# EasyEDA Pro project ProPrj_Piano_scan_for_conserts3_2026-02-26.epro, schematic reuse_base
Board Name: reuse_base; Create Date: 2026-01-01; Page Name: rb; Project Name: Piano_scan_for_conserts3; Schematic Name: reuse_base; Update Date: 2026-01-01; Company: EasyEDA.com; Page Size: A4; Version: V1.0
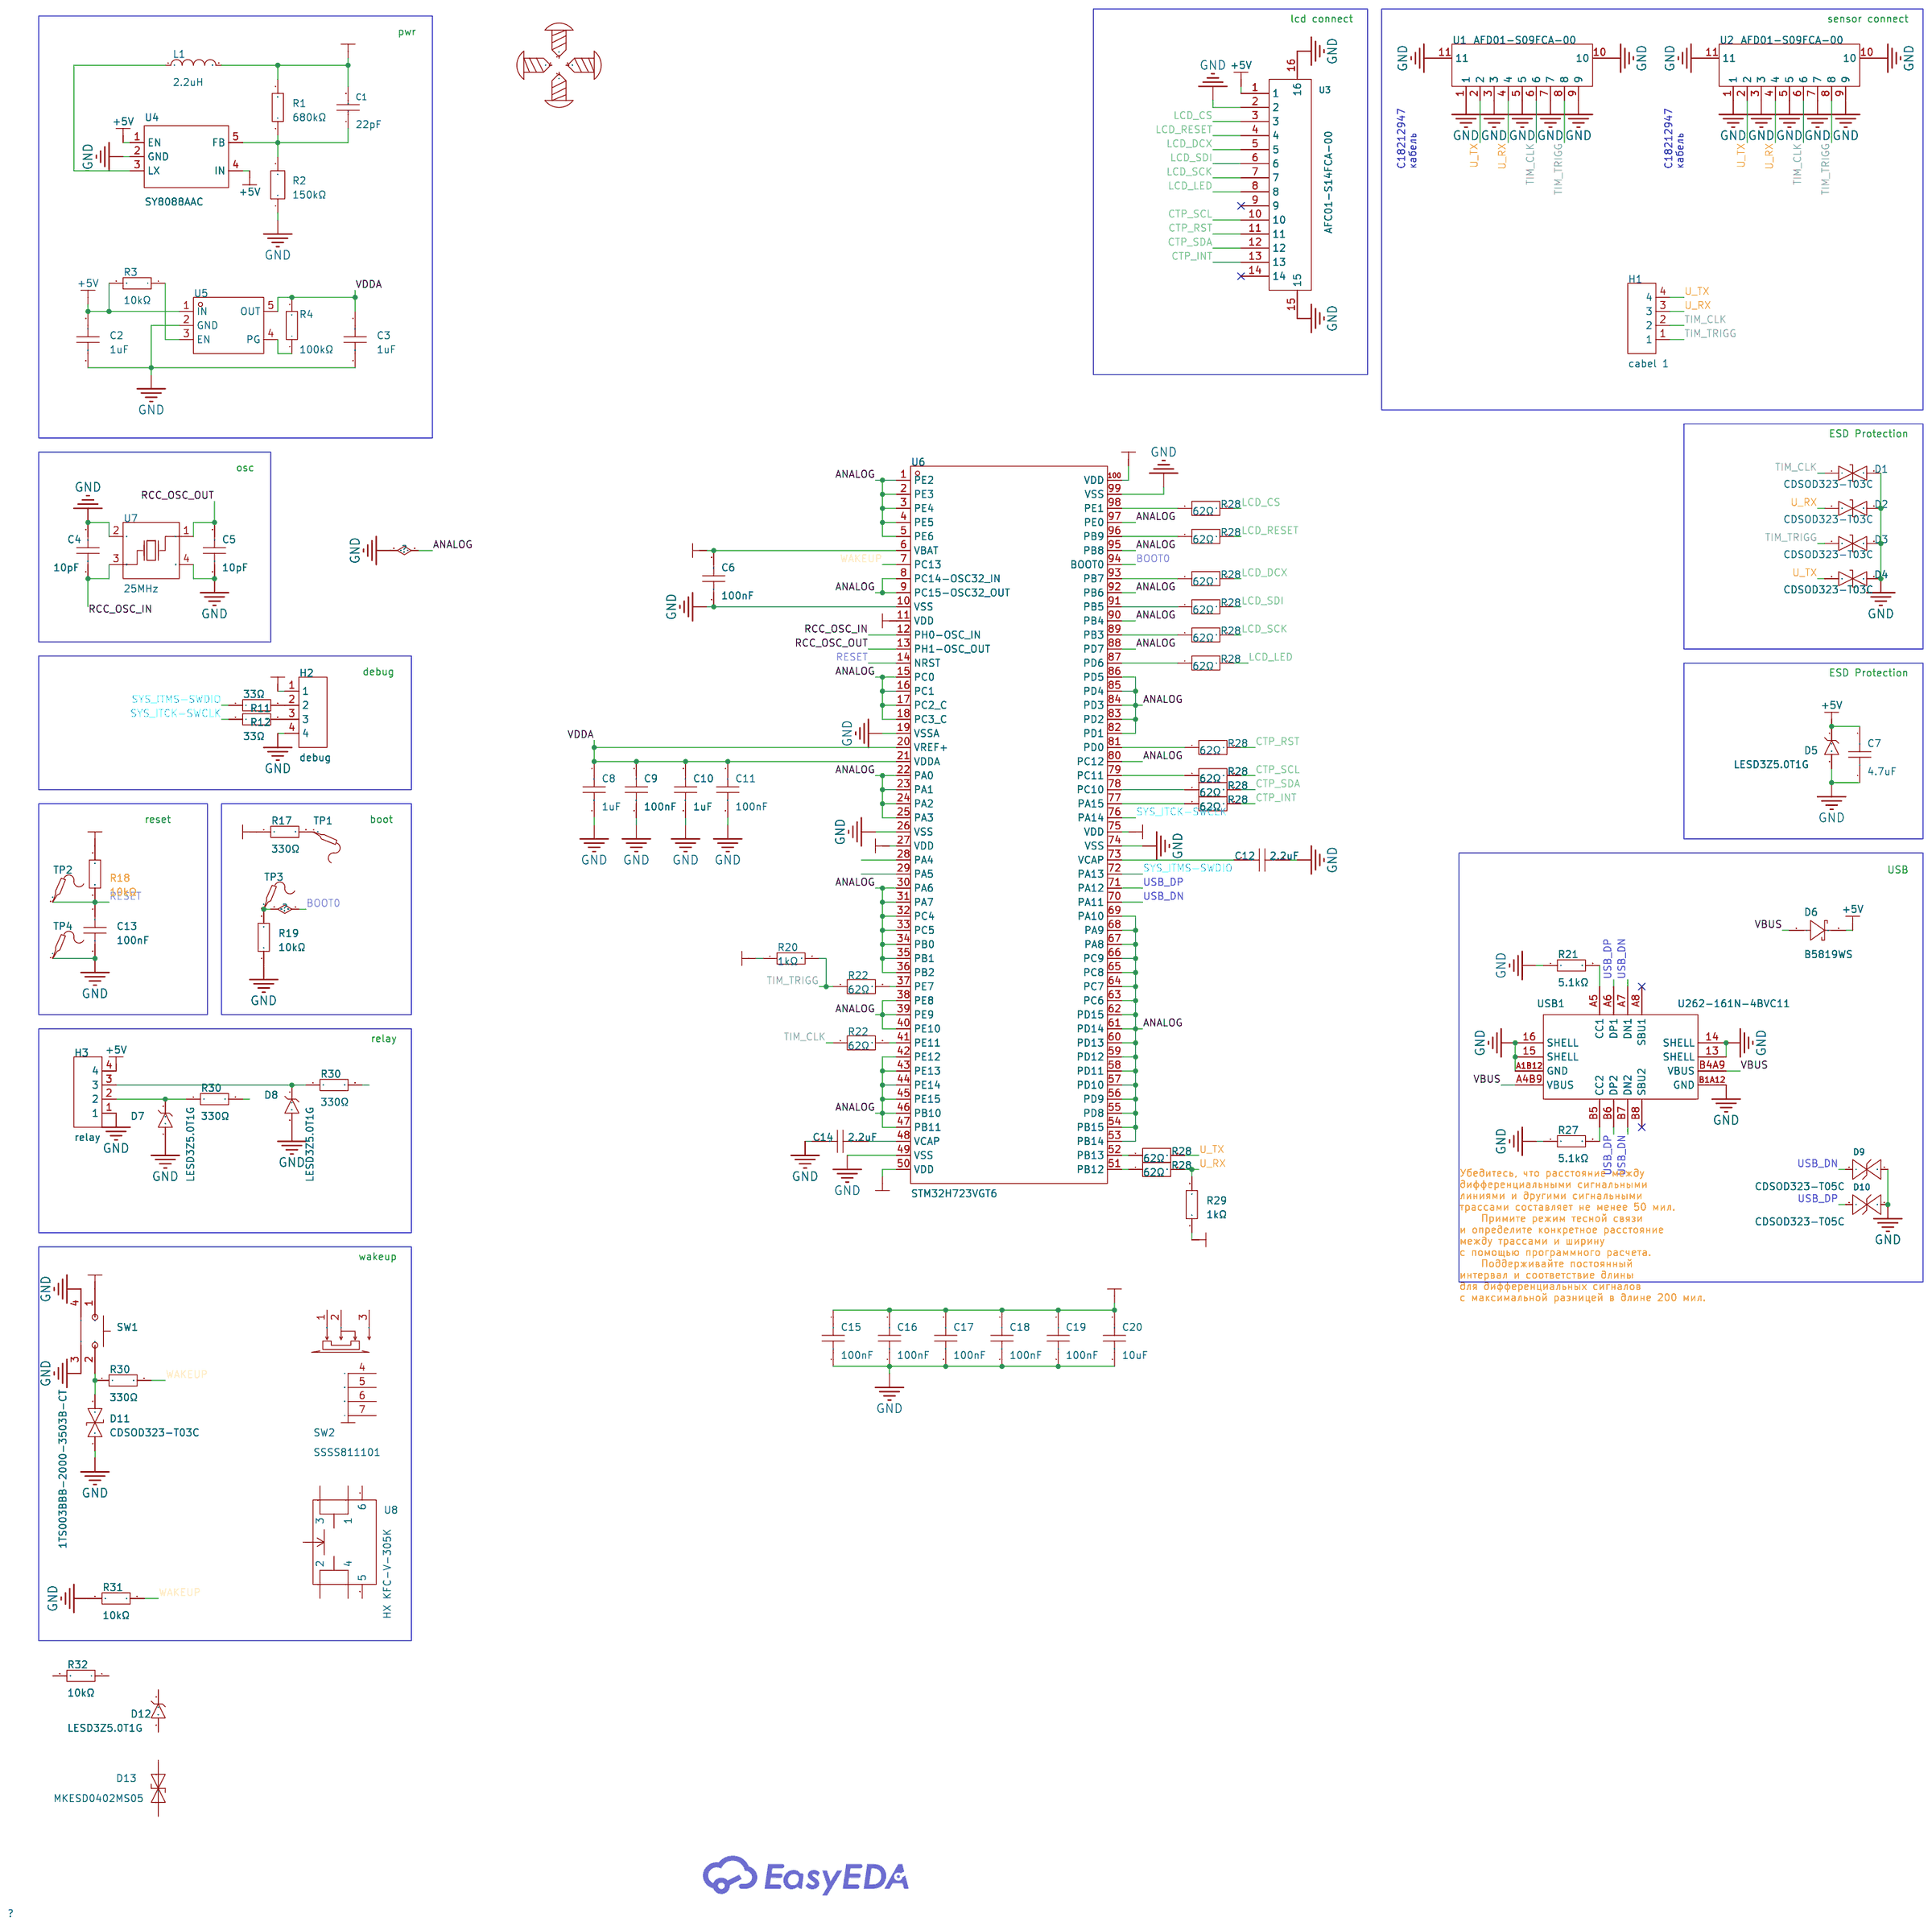
[diagram p0: schematic sheet]

## Parts
C1  22pF  [C0402]
C2  1uF  [C0402]
C3  1uF  [C0402]
C4  10pF  [C0402]
C5  10pF  [C0402]
C6  100nF  [C0402]
C7  4.7uF  [C0402]
C8  1uF  [C0402]
C9  100nF  [C0402]
C10  1uF  [C0402]
C11  100nF  [C0402]
C12  2.2uF  [C0402]
C13  100nF  [C0402]
C14  2.2uF  [C0402]
C15  100nF  [C0402]
C16  100nF  [C0402]
C17  100nF  [C0402]
C18  100nF  [C0402]
C19  100nF  [C0402]
C20  10uF  [C0402]
D1  CDSOD323-T03C  [SOD-323_L1.8-W1.3-LS2.5-BI]
D2  CDSOD323-T03C  [SOD-323_L1.8-W1.3-LS2.5-BI]
D3  CDSOD323-T03C  [SOD-323_L1.8-W1.3-LS2.5-BI]
D4  CDSOD323-T03C  [SOD-323_L1.8-W1.3-LS2.5-BI]
D5  LESD3Z5.0T1G  [SOD-323_L1.8-W1.3-LS2.5-RD]
D6  B5819WS  [SOD-323_L1.7-W1.3-LS2.5-RD]
D7  LESD3Z5.0T1G  [SOD-323_L1.8-W1.3-LS2.5-RD]
D8  LESD3Z5.0T1G  [SOD-323_L1.8-W1.3-LS2.5-RD]
D9  CDSOD323-T05C  [SOD-323_L1.8-W1.3-LS2.5-BI]
D10  CDSOD323-T05C  [SOD-323_L1.8-W1.3-LS2.5-BI]
D11  CDSOD323-T03C  [SOD-323_L1.8-W1.3-LS2.5-BI]
D12  LESD3Z5.0T1G  [SOD-323_L1.8-W1.3-LS2.5-RD]  (no BOM)
D13  MKESD0402MS05  [D0402-BI]  (no BOM)
H1  cabel 1  [HDR-TH_4P-P2.54-V-M]  (no BOM)
H2  debug  [HDR-TH_4P-P2.54-V-M]  (no BOM)
H3  relay  [HDR-TH_4P-P2.54-V-M]  (no BOM)
L1  2.2uH  [IND-SMD_L1.2-W0.7]
R1  680kΩ  [R0402]
R2  150kΩ  [R0402]
R3  10kΩ  [R0402]
R4  100kΩ  [R0402]
R11  33Ω  [R0402]
R12  33Ω  [R0402]
R17  330Ω  [R0402]
R18  10kΩ  [R0402]
R19  10kΩ  [R0402]
R20  1kΩ  [R0402]
R21  5.1kΩ  [R0402]
R22  62Ω  [R0402]
R22#2  62Ω  [R0402]
R27  5.1kΩ  [R0402]
R28  62Ω  [R0402]
R28#2  62Ω  [R0402]
R28#3  62Ω  [R0402]
R28#4  62Ω  [R0402]
R28#5  62Ω  [R0402]
R28#6  62Ω  [R0402]
R28#7  62Ω  [R0402]
R28#8  62Ω  [R0402]
R28#9  62Ω  [R0402]
R28#10  62Ω  [R0402]
R28#11  62Ω  [R0402]
R28#12  62Ω  [R0402]
R29  1kΩ  [R0402]
R30  330Ω  [R0402]
R30#2  330Ω  [R0402]
R30#3  330Ω  [R0402]
R31  10kΩ  [RES-TH_BD1.8-L3.2-P7.20-D0.4]  (no BOM)
R32  10kΩ  [R0402]  (no BOM)
SCREW1  -  [Screw-Hole-M3]  (no BOM)
SCREW2  -  [Screw-Hole-M3]  (no BOM)
SCREW3  -  [Screw-Hole-M3]  (no BOM)
SCREW4  -  [Screw-Hole-M3]  (no BOM)
SW1  1TS003BBB-2000-3503B-CT  [KEY-SMD_1TS003B]
SW2  SSSS811101  [SW-SMD_SSSS811101]  (no BOM)
TP1  -  [Test-Point-0.5mm]  (no BOM)
TP2  -  [Test-Point-0.5mm]  (no BOM)
TP3  -  [Test-Point-0.5mm]  (no BOM)
TP4  -  [Test-Point-0.5mm]  (no BOM)
U1  AFD01-S09FCA-00  [FPC-SMD_9P-P0.50_JS_AFD01-S09FCA-00]
U2  AFD01-S09FCA-00  [FPC-SMD_9P-P0.50_JS_AFD01-S09FCA-00]
U3  AFC01-S14FCA-00  [FPC-SMD_AFC01-S14FCA-00]
U4  SY8088AAC  [SOT-23-5_L3.0-W1.7-P0.95-LS2.8-BR]
U5  LDLN030G33R  [TSOT-23-5_L2.9-W1.6-P0.95-LS2.8-BR]
U6  STM32H723VGT6  [LQFP-100_L14.0-W14.0-P0.50-LS16.0-BL]
U7  25MHz  [CRYSTAL-SMD_4P-L3.2-W2.5-BL-1]
U8  HX KFC-V-305K  [SW-SMD_TM-1022-B]  (no BOM)
USB1  U262-161N-4BVC11  [USB-3.1-SMD_U262-161N-4BVC11]

## Library data of the parts
C1 = CC0402JRNPO9BN220: Capacitance:22pF Tolerance:±5% Tolerance:±5% Voltage Rating:50V Temperature Coefficient:NP0; LCSC Part Name: 22pF ±5% 50V; Supplier Part: C106203; Manufacturer: YAGEO(国巨); Supplier Footprint: 0402; JLCPCB Part Class: Extended Part; Datasheet: https://item.szlcsc.com/datasheet/CC0402JRNPO9BN220/107418.html; Supplier: LCSC; Tolerance: ±5%; Voltage Rating: 50V; Temperature Coefficient: NP0
C2 C3 C8 C10 = CL05A105KA5NQNC: Capacitance: Tolerance:±10% Tolerance:±10% Voltage Rated: Temperature Coefficient:; LCSC Part Name: 1uF ±10% 25V; Supplier Part: C52923; Manufacturer: SAMSUNG(三星); Supplier Footprint: 0402; JLCPCB Part Class: Basic Part; Datasheet: https://atta.szlcsc.com/upload/public/pdf/source/20160218/1457707763339.pdf; Supplier: LCSC; Tolerance: ±10%
C4 C5 = CC0402JRNPO9BN100: Capacitance: Tolerance:±5% Tolerance:±5% Voltage Rated: Temperature Coefficient:; LCSC Part Name: 10pF ±5% 50V; Supplier Part: C106199; Manufacturer: YAGEO(国巨); Supplier Footprint: 0402; JLCPCB Part Class: Extended Part; Datasheet: https://atta.szlcsc.com/upload/public/pdf/source/20181008/C309499_21CC21451B82C39E3D92150FD6B30293.pdf; Supplier: LCSC; Tolerance: ±5%
C6 C9 C11 C13 C15-C19 = CL05B104KO5NNNC: Capacitance: Tolerance:±10% Tolerance:±10% Voltage Rated: Temperature Coefficient:; LCSC Part Name: 100nF ±10% 16V; Supplier Part: C1525; Manufacturer: SAMSUNG(三星); Supplier Footprint: 0402; JLCPCB Part Class: Basic Part; Datasheet: https://atta.szlcsc.com/upload/public/pdf/source/20160218/1457707763339.pdf; Supplier: LCSC; Tolerance: ±10%
C7 = CL05A475MO5NUNC: Capacitance: Tolerance:±20% Tolerance:±20% Voltage Rated: Temperature Coefficient:; LCSC Part Name: 4.7uF ±20% 16V; Supplier Part: C318563; Manufacturer: SAMSUNG(三星); Supplier Footprint: 0402; JLCPCB Part Class: Extended Part; Datasheet: https://atta.szlcsc.com/upload/public/pdf/source/20220707/F14E03FDB4B4C1D977DC3E44ED5514DB.pdf; Supplier: LCSC; Tolerance: ±20%
C12 C14 = CL05A225KO5NQNC: Capacitance: Tolerance:±10% Tolerance:±10% Voltage Rated: Temperature Coefficient:; LCSC Part Name: 2.2uF ±10% 16V; Supplier Part: C170151; Manufacturer: SAMSUNG(三星); Supplier Footprint: 0402; JLCPCB Part Class: Extended Part; Datasheet: https://atta.szlcsc.com/upload/public/pdf/source/20160218/1457707763339.pdf; Supplier: LCSC; Tolerance: ±10%
C20 = CL05A106MQ5NUNC: Capacitance: Tolerance:±20% Tolerance:±20% Voltage Rated: Temperature Coefficient:; LCSC Part Name: 10uF ±20% 6.3V; Supplier Part: C15525; Manufacturer: SAMSUNG(三星); Supplier Footprint: 0402; JLCPCB Part Class: Basic Part; Datasheet: https://atta.szlcsc.com/upload/public/pdf/source/20220823/2B02EE04F8F211D38A52DCB16EB6BEBA.pdf; Supplier: LCSC; Tolerance: ±20%
D1-D4 D11 = CDSOD323-T03C: Reverse Stand-Off Voltage (Vrwm):3.3V Maximum Clamping Voltage:19V Peak Pulse Power Dissipation (Ppp)@10/1000us:350W Breakdown Voltage:4V Number of Lines:单路 Operating Temperature:-55℃~+150℃@(Tj) Operating Temperature:-55℃~+150℃@(Tj) Type:ESD; Supplier Part: C711705; Manufacturer: BOURNS; Supplier Footprint: SOD-323; JLCPCB Part Class: Extended Part; Datasheet: https://atta.szlcsc.com/upload/public/pdf/source/20200729/C711705_B092C80AA6073E77CC27CA73EB4B9B57.pdf; Supplier: LCSC; Reverse Stand-Off Voltage (Vrwm): 3.3V; Maximum Clamping Voltage: 19V; Peak Pulse Power Dissipation (Ppp)@10/1000us: 350W; Breakdown Voltage: 4V; Number of Lines: 单路; Operating Temperature: -55℃~+150℃@(Tj); Type: ESD
D5 D7 D8 D12 = LESD3Z5.0T1G: polarity:Unidirectional Reverse Stand-Off Voltage (Vrwm):5V Maximum Clamping Voltage:9.8V Peak Pulse Current (Ipp):5A Breakdown Voltage:6V Type:ESD; LCSC Part Name: 单向ESD; Supplier Part: C383210; Manufacturer: LRC(乐山无线电); Supplier Footprint: SOD-323; JLCPCB Part Class: Extended Part; Datasheet: https://atta.szlcsc.com/upload/public/pdf/source/20190402/C383210_DDD0E74F94EB08ED87EF5997177DDCE4.pdf; Supplier: LCSC; polarity: Unidirectional; Reverse Stand-Off Voltage (Vrwm): 5V; Maximum Clamping Voltage: 9.8V; Peak Pulse Current (Ipp): 5A; Breakdown Voltage: 6V; Type: ESD
D6 = B5819WS_C916992: Forward Voltage (Vf@If):600mV@1A Reverse Voltage (Vr):40V Rectified Current:1A Reverse Leakage Current (Ir):1mA@40V; LCSC Part Name: 电压:40V 电流:1A; Supplier Part: C916992; Manufacturer: JSMSEMI(杰盛微); Supplier Footprint: SOD-323; JLCPCB Part Class: Extended Part; Datasheet: https://atta.szlcsc.com/upload/public/pdf/source/20230807/E118DF7B8391036A3C9742A49E2062A6.pdf; Supplier: LCSC; Forward Voltage (Vf@If): 600mV@1A; Reverse Voltage (Vr): 40V; Rectified Current: 1A; Reverse Leakage Current (Ir): 1mA@40V
D9 D10 = CDSOD323-T05C: Maximum Clamping Voltage:18.3V Breakdown Voltage:6V Number of Lines:单路 Type:ESD; Supplier Part: C711706; Manufacturer: BOURNS; Supplier Footprint: SOD-323; JLCPCB Part Class: Extended Part; Datasheet: https://atta.szlcsc.com/upload/public/pdf/source/20200729/C711705_B092C80AA6073E77CC27CA73EB4B9B57.pdf; Supplier: LCSC; Maximum Clamping Voltage: 18.3V; Breakdown Voltage: 6V; Number of Lines: 单路; Type: ESD
D13 = MKESD0402MS05: Maximum Clamping Voltage:40V Type:ESD; LCSC Part Name: 停产; Supplier Part: C379107; Supplier Footprint: 0402; JLCPCB Part Class: Extended Part; Datasheet: https://atta.szlcsc.com/upload/public/pdf/source/20190621/C379107_0EACA80B6F1F1E245949AB39A6E05B4D.pdf; Supplier: LCSC; Maximum Clamping Voltage: 40V; Type: ESD
H1-H3 = HDR-M_2.54_1x4P: Supplier Footprint: Through
L1 = WI0402IF2R2KST-HF: Inductance:2.2uH Tolerance:±10% Tolerance:±10% Current Rating:- Current - Saturation (Isat):40mA DC Resistance(DCR):2.3Ω Q @ Frequency:- Frequency - Self Resonant:100MHz Ratings:- Type:Wirewound Chip Inductor; LCSC Part Name: 2.2uH ±10% 40mA; Supplier Part: C18221127; Manufacturer: DDY(德立); Supplier Footprint: 0402; JLCPCB Part Class: Extended Part; Datasheet: https://item.szlcsc.com/datasheet/WI0402IF2R2KST-HF/19401023.html; Supplier: LCSC; Tolerance: ±10%; Current - Saturation (Isat): 40mA; DC Resistance(DCR): 2.3Ω; Frequency - Self Resonant: 100MHz; Type: Wirewound Chip Inductor
R1 = RC0402FR-07680KL: Type:Thick Film Resistor Resistance:680kΩ Tolerance:±1% Tolerance:±1% Power(Watts):62.5mW Voltage-Supply(Max):50V Temperature Coefficient:±100ppm/℃ Temperature Coefficient:±100ppm/℃ Operating Temperature:-55℃~+155℃ Operating Temperature:-55℃~+155℃; LCSC Part Name: 厚膜电阻 680kΩ ±1% 62.5mW; Supplier Part: C163456; Manufacturer: YAGEO(国巨); Supplier Footprint: 0402; JLCPCB Part Class: Extended Part; Datasheet: https://item.szlcsc.com/datasheet/RC0402FR-07680KL/174837.html; Supplier: LCSC; Type: Thick Film Resistor; Tolerance: ±1%; Power(Watts): 62.5mW; Voltage-Supply(Max): 50V; Temperature Coefficient: ±100ppm/℃; Operating Temperature: -55℃~+155℃
R2 = RT0402BRD07150KL: Type:Thin Film Resistor Resistance:150kΩ Tolerance:±0.1% Tolerance:±0.1% Power(Watts):63mW Voltage-Supply(Max):50V Temperature Coefficient:±25ppm/℃ Temperature Coefficient:±25ppm/℃ Operating Temperature:-55℃~+155℃ Operating Temperature:-55℃~+155℃; LCSC Part Name: 薄膜电阻 150kΩ ±0.1% 63mW; Supplier Part: C852538; Manufacturer: YAGEO(国巨); Supplier Footprint: 0402; JLCPCB Part Class: Extended Part; Datasheet: https://item.szlcsc.com/datasheet/RT0402BRD07150KL/912860.html; Supplier: LCSC; Type: Thin Film Resistor; Tolerance: ±0.1%; Power(Watts): 63mW; Voltage-Supply(Max): 50V; Temperature Coefficient: ±25ppm/℃; Operating Temperature: -55℃~+155℃
R3 R18 R19 R32 = RC0402FR-0710KL: Type:Thick Film Resistors Resistance: Tolerance:±1% Tolerance:±1% Power(Watts): Overload Voltage (Max): Temperature Coefficient:±100ppm/℃ Temperature Coefficient:±100ppm/℃ Operating Temperature Range:-55℃~+155℃ Operating Temperature Range:-55℃~+155℃; LCSC Part Name: 厚膜电阻 10kΩ ±1% 62.5mW; Supplier Part: C60490; Manufacturer: YAGEO(国巨); Supplier Footprint: 0402; JLCPCB Part Class: Extended Part; Datasheet: https://atta.szlcsc.com/upload/public/pdf/source/20170925/C131467_1506321478108990263.pdf; Supplier: LCSC; Type: Thick Film Resistors; Tolerance: ±1%; Temperature Coefficient: ±100ppm/℃; Operating Temperature Range: -55℃~+155℃
R4 = RC0402FR-07100KL: Type:Thick Film Resistors Resistance: Tolerance:±1% Tolerance:±1% Power(Watts): Overload Voltage (Max): Temperature Coefficient:±100ppm/℃ Temperature Coefficient:±100ppm/℃ Operating Temperature Range:-55℃~+155℃ Operating Temperature Range:-55℃~+155℃; LCSC Part Name: 厚膜电阻 100kΩ ±1% 62.5mW; Supplier Part: C60491; Manufacturer: YAGEO(国巨); Supplier Footprint: 0402; JLCPCB Part Class: Extended Part; Datasheet: https://atta.szlcsc.com/upload/public/pdf/source/20180927/C295883_E8D83085EA81BD7DE0B2B681138C15EE.pdf; Supplier: LCSC; Type: Thick Film Resistors; Tolerance: ±1%; Temperature Coefficient: ±100ppm/℃; Operating Temperature Range: -55℃~+155℃
R11 R12 = RC0402FR-0733RL: Type:Thick Film Resistors Resistance: Tolerance:±1% Tolerance:±1% Power(Watts): Overload Voltage (Max): Temperature Coefficient:±100ppm/℃ Temperature Coefficient:±100ppm/℃ Operating Temperature Range:-55℃~+155℃ Operating Temperature Range:-55℃~+155℃; LCSC Part Name: 厚膜电阻 33Ω ±1% 62.5mW; Supplier Part: C138002; Manufacturer: YAGEO(国巨); Supplier Footprint: 0402; JLCPCB Part Class: Extended Part; Datasheet: https://atta.szlcsc.com/upload/public/pdf/source/20181009/C309620_DA5935B6E1D48212CB7A533FE518B3C2.pdf; Supplier: LCSC; Type: Thick Film Resistors; Tolerance: ±1%; Temperature Coefficient: ±100ppm/℃; Operating Temperature Range: -55℃~+155℃
R17 R30 R30#2 R30#3 = RC0402FR-07330RL: Type:Thick Film Resistors Resistance: Tolerance:±1% Tolerance:±1% Power(Watts): Overload Voltage (Max): Temperature Coefficient:±100ppm/℃ Temperature Coefficient:±100ppm/℃ Operating Temperature Range:-55℃~+155℃ Operating Temperature Range:-55℃~+155℃; LCSC Part Name: 厚膜电阻 330Ω ±1% 62.5mW; Supplier Part: C105875; Manufacturer: YAGEO(国巨); Supplier Footprint: 0402; JLCPCB Part Class: Extended Part; Datasheet: https://atta.szlcsc.com/upload/public/pdf/source/20180821/C275644_0D56F95EFF785E7D9A1FEF436B37DA78.pdf; Supplier: LCSC; Type: Thick Film Resistors; Tolerance: ±1%; Temperature Coefficient: ±100ppm/℃; Operating Temperature Range: -55℃~+155℃
R20 R29 = RC0402FR-071KL: Type:Thick Film Resistors Resistance: Tolerance:±1% Tolerance:±1% Power(Watts): Overload Voltage (Max): Temperature Coefficient:±100ppm/℃ Temperature Coefficient:±100ppm/℃ Operating Temperature Range:-55℃~+155℃ Operating Temperature Range:-55℃~+155℃; LCSC Part Name: 厚膜电阻 1kΩ ±1% 62.5mW; Supplier Part: C106235; Manufacturer: YAGEO(国巨); Supplier Footprint: 0402; JLCPCB Part Class: Extended Part; Datasheet: https://atta.szlcsc.com/upload/public/pdf/source/20180927/C295883_E8D83085EA81BD7DE0B2B681138C15EE.pdf; Supplier: LCSC; Type: Thick Film Resistors; Tolerance: ±1%; Temperature Coefficient: ±100ppm/℃; Operating Temperature Range: -55℃~+155℃
R21 R27 = RC0402FR-075K1L: Type:Thick Film Resistors Resistance:5.1kΩ Tolerance:±1% Tolerance:±1% Power(Watts):62.5mW Voltage-Supply(Max):50V Temperature Coefficient:±100ppm/℃ Temperature Coefficient:±100ppm/℃ Operating Temperature:-55℃~+155℃ Operating Temperature:-55℃~+155℃; LCSC Part Name: 厚膜电阻 5.1kΩ ±1% 62.5mW; Supplier Part: C105872; Manufacturer: YAGEO(国巨); Supplier Footprint: 0402; JLCPCB Part Class: Extended Part; Datasheet: https://atta.szlcsc.com/upload/public/pdf/source/20180821/C275644_0D56F95EFF785E7D9A1FEF436B37DA78.pdf; Supplier: LCSC; Type: Thick Film Resistors; Tolerance: ±1%; Power(Watts): 62.5mW; Voltage-Supply(Max): 50V; Temperature Coefficient: ±100ppm/℃; Operating Temperature: -55℃~+155℃
R22 R22#2 R28 R28#2-R28#12 = FRC0402F62R0TS: Type:Thick Film Resistors Resistance: Tolerance:±1% Tolerance:±1% Power(Watts): Voltage-Supply(Max): Temperature Coefficient:±100ppm/℃ Temperature Coefficient:±100ppm/℃ Operating Temperature:-55℃~+155℃ Operating Temperature:-55℃~+155℃; LCSC Part Name: 62Ω ±1% 62.5mW 厚膜电阻; Supplier Part: C2909376; Manufacturer: FOJAN(富捷); Supplier Footprint: 0402; JLCPCB Part Class: Extended Part; Datasheet: https://atta.szlcsc.com/upload/public/pdf/source/20211221/925EC7D7225764EE0046F22065062C87.pdf; Supplier: LCSC; Type: Thick Film Resistors; Tolerance: ±1%; Temperature Coefficient: ±100ppm/℃; Operating Temperature: -55℃~+155℃
R31 = Res_AXIAL-1/8W: Supplier Footprint: Through
SCREW1-SCREW4 = Screw-Hole-M3: Supplier Footprint: 插件
SW1 = 1TS003BBB-2000-3503B-CT: Circuit:SPST Actuator Style:Rectangle button Operating Force:200gf Mounting Style:卧贴 Switch Length:4.6mm Switch Width:1.82mm Switch Height:3.5mm Strike Gundam:不带 Contact Current:50mA Voltage Rating (DC):12V Power Rating:0.6W Insulation Resistance:100MΩ Ac; LCSC Part Name: 4.6*1.82*3.5mm 卧贴 轻触开关; Supplier Part: C319403; Manufacturer: HYP(鸿源精密); Supplier Footprint: SMD,1.8x4.6mm; JLCPCB Part Class: Extended Part; Datasheet: https://atta.szlcsc.com/upload/public/pdf/source/20181106/C319403_38322AD38D47FEA30B9D8C4E03F0198F.pdf; Supplier: LCSC; Circuit: SPST; Actuator Style: Rectangle button; Operating Force: 200gf; Mounting Style: 卧贴; Switch Length: 4.6mm; Switch Width: 1.82mm; Switch Height: 3.5mm; Strike Gundam: 不带; Contact Current: 50mA; Voltage Rating (DC): 12V; Power Rating: 0.6W; Insulation Resistance: 100MΩ; Actuator/Cap Color: Black; With Lamp: No; Pin Style: J pin; Mechanical Life: 10万次; Operating Temperature: -40℃~+90℃
SW2 = SSSS811101: Circuit:Single Pole Double Throw (SPDT) Actuator Style:Rectangular column Pin Style:SMDSplicing Switch Height:4.1mm Mounting Style:Horizontal attachment Current Rating (DC):300mA Voltage Rating (DC):5V Current Rating (AC):- Voltage Rating (AC):- Mechanica; Supplier Part: C109335; Manufacturer: ALPSALPINE(阿尔卑斯阿尔派); Supplier Footprint: SMD; JLCPCB Part Class: Extended Part; Datasheet: https://atta.szlcsc.com/upload/public/pdf/source/20170620/1497944730069.pdf; Supplier: LCSC; Circuit: Single Pole Double Throw (SPDT); Actuator Style: Rectangular column; Pin Style: SMDSplicing; Switch Height: 4.1mm; Mounting Style: Horizontal attachment; Current Rating (DC): 300mA; Voltage Rating (DC): 5V; Mechanical Life: 10,000 times; Operating Temperature: -40℃~+85℃
TP1-TP4 = Test-Point: Test Point 测试点
U1 U2 = AFD01-S09FCA-00: Locking Feature:Flip type Contact Type:Bottom Contact Number of Contacts:9P Pitch:0.5mm Mounting Type:Surface Mount Height Above Board:2mm; LCSC Part Name: 间距:0.5mm P数:9P 翻盖式 下接; Supplier Part: C18198577; Manufacturer: JS(钜硕电子); Supplier Footprint: SMD,P=0.5mm,卧贴; JLCPCB Part Class: Extended Part; Datasheet: https://atta.szlcsc.com/upload/public/pdf/source/20230921/C984413AEFF3A883511B509B58F9A1F7.pdf; Supplier: LCSC; Locking Feature: Flip type; Contact Type: Bottom Contact; Number of Contacts: 9P; Pitch: 0.5mm; Mounting Type: Surface Mount; Height Above Board: 2mm
U3 = AFC01-S14FCA-00: Locking Feature:Clamshell Contact Type:Bottom Contact Number of Contacts:14P Pitch:0.5mm Mounting Type:卧贴 FFC, FCB Thickness:0.3mm FFC, FCB Thickness:0.3mm Height Above Board:2mm Operating Temperature Range:- Operating Temperature Range:-; LCSC Part Name: 间距:0.5mm P数:14P 翻盖式 下接; Supplier Part: C262663; Manufacturer: JS(钜硕电子); Supplier Footprint: SMD,P=0.5mm,卧贴; JLCPCB Part Class: Extended Part; Datasheet: https://atta.szlcsc.com/upload/public/pdf/source/20190816/C413942_2A72D1AC756EAE17EEDF756A339D4500.pdf; Supplier: LCSC; Locking Feature: Clamshell; Contact Type: Bottom Contact; Number of Contacts: 14P; Pitch: 0.5mm; Mounting Type: 卧贴; FFC, FCB Thickness: 0.3mm; Height Above Board: 2mm
U4 = SY8088AAC: Function:Step-down type Output Type:- Voltage - Supply:2.5V~5.5V Voltage - Supply:2.5V~5.5V Output Voltage:- Output Voltage:- Output Current:- Frequency - Switching:1.5MHz Frequency - Switching:1.5MHz Operating Temperature:-40℃~+125℃ Operating Temperature; LCSC Part Name: 1.5MHz 1A 同步降压DC/DC调节器; Supplier Part: C79313; Manufacturer: silergy(矽力杰); Supplier Footprint: SOT-23-5; JLCPCB Part Class: Extended Part; Datasheet: https://atta.szlcsc.com/upload/public/pdf/source/20170329/1490752163260.pdf; Supplier: LCSC; Function: Step-down type; Voltage - Supply: 2.5V~5.5V; Frequency - Switching: 1.5MHz; Operating Temperature: -40℃~+125℃; Synchronous Rectifier: Yes; Number of Outputs: 1; Topology: Step-down; Quiescent Current: 40uA
U5 = LDLN030G33R: Output Type:Fixed Maximum Input Voltage:5.5V Output Voltage:3.3V Output Voltage:3.3V Output Current:300mA Dropout Voltage:230mV@(300mA) standby current:30uA Feature:Low ESR；Thermal Protection(TSD)；Overcurrent Protection(OCP)；With ability Operating Tempera; LCSC Part Name: 300 mA超低噪声LDO，带供电正常指示和软启动功能; Supplier Part: C2688672; Manufacturer: ST(意法半导体); Supplier Footprint: TSOT-23-5; JLCPCB Part Class: Extended Part; Datasheet: https://atta.szlcsc.com/upload/public/pdf/source/20210324/C2688672_742C24F7CE986B82804365FE2FD46427.pdf; Supplier: LCSC; Output Type: Fixed; Maximum Input Voltage: 5.5V; Output Voltage: 3.3V; Output Current: 300mA; Dropout Voltage: 230mV@(300mA); standby current: 30uA; Feature: Low ESR；Thermal Protection(TSD)；Overcurrent Protection(OCP)；With ability; Operating Temperature: -40℃~+125℃@(Tj); Output Polarity: Positive electrode; Number of Outputs: 1
U6 = STM32H723VGT6: CPU Core:ARM-MSeries CPU Maximum Speed:550MHz Program Storage Size:1MB Program Memory Type:FLASH Number of I/O:80 ADC (Bit):16bit DAC (Bit):12bit Voltage - Supply:1.71V~3.6V Voltage - Supply:1.71V~3.6V Applications:-; LCSC Part Name: 高性能和带 DP-FPU 的 DSP、1 MByte 闪存的 Arm Cortex-M7 微控制器、564 Kbyte RAM、550 MHz CPU、L1 缓存、外部内存接口、外围设备子集; Supplier Part: C730142; Manufacturer: ST(意法半导体); Supplier Footprint: LQFP-100(14x14); JLCPCB Part Class: Extended Part; Datasheet: https://atta.szlcsc.com/upload/public/pdf/source/20200902/C730141_32325B298F902737689CA9A88D6BD2F2.pdf; Supplier: LCSC; CPU Core: ARM-MSeries; CPU Maximum Speed: 550MHz; Program Storage Size: 1MB; Program Memory Type: FLASH; Number of I/O: 80; ADC (Bit): 16bit; DAC (Bit): 12bit; Voltage - Supply: 1.71V~3.6V
U7 = 3225-25-10-10-10/A: Frequency:25MHz Normal temperature Frequency Tolerance:±10ppm Normal temperature Frequency Tolerance:±10ppm External load capacitor: Operating Temperature: Operating Temperature:; LCSC Part Name: 25MHz ±10ppm 10pF; Supplier Part: C2981674; Manufacturer: LIMING(利明); Supplier Footprint: SMD3225-4P; JLCPCB Part Class: Extended Part; Datasheet: https://atta.szlcsc.com/upload/public/pdf/source/20220322/AC676597CC3A40062114C19917D1493D.pdf; Supplier: LCSC; Normal temperature Frequency Tolerance: ±10ppm
U8 = HX KFC-V-305K: Type:Micro switch Circuit:SPST Contact Current (DC):500mA Voltage Rating (DC):16V Mechanical Life:20,000 Times Operating Temperature:-30℃~+85℃ Operating Temperature:-30℃~+85℃; LCSC Part Name: 小型微动开关 4脚卧贴 圆柱柄 自复位; Supplier Part: C7527483; Manufacturer: hanxia(韩下); Supplier Footprint: SMD; JLCPCB Part Class: Extended Part; Datasheet: https://atta.szlcsc.com/upload/public/pdf/source/20230817/203ED2BB2738DEA68AF94C5091432D95.pdf; Supplier: LCSC; Type: Micro switch; Circuit: SPST; Contact Current (DC): 500mA; Voltage Rating (DC): 16V; Mechanical Life: 20,000 Times; Operating Temperature: -30℃~+85℃
USB1 = U262-161N-4BVC11: Connector Type:Type-C Standard:- Gender:Female Mounting Style:- Number of Contacts:16P Number of Ports:1 Current Rating - Power (Max):3A Contact Material:Copper alloy Contact Plating:Gold Operating Temperature Range:-40℃~+85℃ Operating Temperature Range:-; LCSC Part Name: Type-C 母; Supplier Part: C319148; Manufacturer: XKB Connection(中国星坤); Supplier Footprint: SMD; JLCPCB Part Class: Extended Part; Datasheet: https://atta.szlcsc.com/upload/public/pdf/source/20240531/F14485311DEC5B9A6D2942561CACC97C.pdf; Supplier: LCSC; Connector Type: Type-C; Gender: Female; Number of Contacts: 16P; Number of Ports: 1; Current Rating - Power (Max): 3A; Contact Material: Copper alloy; Contact Plating: Gold; Operating Temperature Range: -40℃~+85℃; Soldering Temperature(Max): 260℃

## Nets
+3V3: C1.2 C6.2 C15.1 C16.1 C17.1 C18.1 C19.1 C20.1 H2.1 L1.2 R1.2 R17.1 R18.1 R20.1 R29.1 SW1.1 U6.6(VBAT) U6.11(VDD) U6.27(VDD) U6.50(VDD) U6.75(VDD) U6.100(VDD)
+5V: C2.1 C7.2 D5.1 D6.1(K) H3.4 R3.2 U3.1 U4.1(EN) U4.4(IN) U5.1(IN)
GND: C2.2 C3.2 C4.1 C5.2 C6.1 C7.1 C8.2 C9.2 C10.2 C11.2 C12.1 C13.2 C14.2 C15.2 C16.2 C17.2 C18.2 C19.2 C20.2 D1.2 D2.2 D3.2 D4.2 D5.2 D7.2 D8.2 D9.2(A) D10.2(A) D11.1 H2.4 H3.1 R2.1 R19.1 R21.1 R27.1 R31.1 SW1.3 SW1.4 TP4.1 U1.1 U1.3 U1.5 U1.7 U1.9 U1.10 U1.11 U2.1 U2.3 U2.5 U2.7 U2.9 U2.10 U2.11 U3.2 U3.15 U3.16 U4.2(GND) U5.2(GND) U6.1(PE2) U6.2(PE3) U6.3(PE4) U6.4(PE5) U6.5(PE6) U6.8(PC14-OSC32_IN) U6.9(PC15-OSC32_OUT) U6.10(VSS) U6.15(PC0) U6.16(PC1) U6.17(PC2_C) U6.18(PC3_C) U6.19(VSSA) U6.22(PA0) U6.23(PA1) U6.24(PA2) U6.25(PA3) U6.26(VSS) U6.30(PA6) U6.31(PA7) U6.32(PC4) U6.33(PC5) U6.34(PB0) U6.35(PB1) U6.36(PB2) U6.38(PE8) U6.39(PE9) U6.40(PE10) U6.42(PE12) U6.43(PE13) U6.44(PE14) U6.45(PE15) U6.46(PB10) U6.47(PB11) U6.49(VSS) U6.53(PB14) U6.54(PB15) U6.55(PD8) U6.56(PD9) U6.57(PD10) U6.58(PD11) U6.59(PD12) U6.60(PD13) U6.61(PD14) U6.62(PD15) U6.63(PC6) U6.64(PC7) U6.65(PC8) U6.66(PC9) U6.67(PA8) U6.68(PA9) U6.69(PA10) U6.74(VSS) U6.80(PC12) U6.82(PD1) U6.83(PD2) U6.84(PD3) U6.85(PD4) U6.86(PD5) U6.88(PD7) U6.90(PB4) U6.92(PB6) U6.95(PB8) U6.97(PE0) U6.99(VSS) U7.2(GND) U7.4(GND) USB1.13(SHELL) USB1.14(SHELL) USB1.15(SHELL) USB1.16(SHELL) USB1.A1B12(GND) USB1.B1A12(GND)
VBUS: D6.2(A) USB1.A4B9(VBUS) USB1.B4A9(VBUS)
VDDA: C3.1 C8.1 C9.1 C10.1 C11.1 R4.2 U5.5(OUT) U6.20(VREF+) U6.21(VDDA)
BOOT0: R19.2 TP3.1 U6.94(BOOT0)
CTP_INT: R28#3.2 U3.13
CTP_RST: R28#6.2 U3.11
CTP_SCL: R28#5.2 U3.10
CTP_SDA: R28#4.2 U3.12
LCD_CS: R28#8.2 U3.3
LCD_DCX: R28#10.2 U3.5
LCD_LED: R28#7.2 U3.8
LCD_RESET: R28#9.2 U3.4
LCD_SCK: R28#12.2 U3.7
LCD_SDI: R28#11.2 U3.6
RCC_OSC_IN: C4.2 U6.12(PH0-OSC_IN) U7.3(OSC2)
RCC_OSC_OUT: C5.1 U6.13(PH1-OSC_OUT) U7.1(OSC1)
RELAY_1: R30#3.2 U6.28(PA4)
RELAY_2: R30#2.2 U6.29(PA5)
RESET: C13.1 R18.2 TP2.1 U6.14(NRST)
SYS_ITCK-SWCLK: R12.1 U6.76(PA14)
SYS_ITMS-SWDIO: R11.1 U6.72(PA13)
TIM_CLK: D1.1 H1.2 R22#2.1 U1.6 U2.6
TIM_TRIGG: D3.1 H1.1 R20.2 R22.1 U1.8 U2.8
U_RX: D2.1 H1.3 R28.2 R29.2 U1.4 U2.4
U_TX: D4.1 H1.4 R28#2.2 U1.2 U2.2
USB_DN: D9.1(K) U6.70(PA11) USB1.A7(DN1) USB1.B7(DN2)
USB_DP: D10.1(K) U6.71(PA12) USB1.A6(DP1) USB1.B6(DP2)
WAKEUP: R30.2 R31.2 U6.7(PC13)
$1N5542: D11.2 R30.1 SW1.2
$1N5554: H2.3 R12.2
$1N5555: H2.2 R11.2
$1N5563: R17.2 TP1.1
$1N5590: R21.2 USB1.A5(CC1)
Net-(C1-1): C1.1 R1.1 R2.2 U4.5(FB)
Net-(C12-2): C12.2 U6.73(VCAP)
Net-(C14-1): C14.1 U6.48(VCAP)
Net-(D7-1): D7.1 H3.2 R30#2.1
Net-(D8-1): D8.1 H3.3 R30#3.1
Net-(L1-1): L1.1 U4.3(LX)
Net-(R3-1): R3.1 U5.3(EN)
Net-(R4-1): R4.1 U5.4(PG)
Net-(R22#2-2): R22#2.2 U6.41(PE11)
Net-(R22-2): R22.2 U6.37(PE7)
Net-(R27-2): R27.2 USB1.B5(CC2)
Net-(R28#2-1): R28#2.1 U6.52(PB13)
Net-(R28#3-1): R28#3.1 U6.77(PA15)
Net-(R28#4-1): R28#4.1 U6.78(PC10)
Net-(R28#5-1): R28#5.1 U6.79(PC11)
Net-(R28#6-1): R28#6.1 U6.81(PD0)
Net-(R28#7-1): R28#7.1 U6.87(PD6)
Net-(R28#8-1): R28#8.1 U6.98(PE1)
Net-(R28#9-1): R28#9.1 U6.96(PB9)
Net-(R28#10-1): R28#10.1 U6.93(PB7)
Net-(R28#11-1): R28#11.1 U6.91(PB5)
Net-(R28#12-1): R28#12.1 U6.89(PB3)
Net-(R28-1): R28.1 U6.51(PB12)

Not connected (* = marked no-connect by the designer): D12 1 2; D13 1 2; R32 1 2; SCREW1 1; SCREW2 1; SCREW3 1; SCREW4 1; SW2 1 2 3 4 5 6 7; U3 9* 14*; U8 1 2 3 4 5 6; USB1 A8(SBU1)* B8(SBU2)*

## Notes on the sheet
- lcd connect
- sensor connect
- pwr
- C18212947
  кабель
- C18212947
  кабель
- ESD Protection
- osc
- debug
- ESD Protection
- reset
- boot
- USB
- relay
- wakeup
- Убедитесь, что расстояние между
  дифференциальными сигнальными
  линиями и другими сигнальными
  трассами составляет не менее 50 мил.
      Примите режим тесной связи
  и определите конкретное расстояние
  между трассами и ширину
  с помощью программного расчета.
      Поддерживайте постоянный
  интервал и соответствие длины
  для дифференциальных сигналов
  с максимальной разницей в длине 200 мил.
